# Altium schematic sheet Buck2.SchDoc
size A4; SheetNumber: 4; SheetTotal: 5
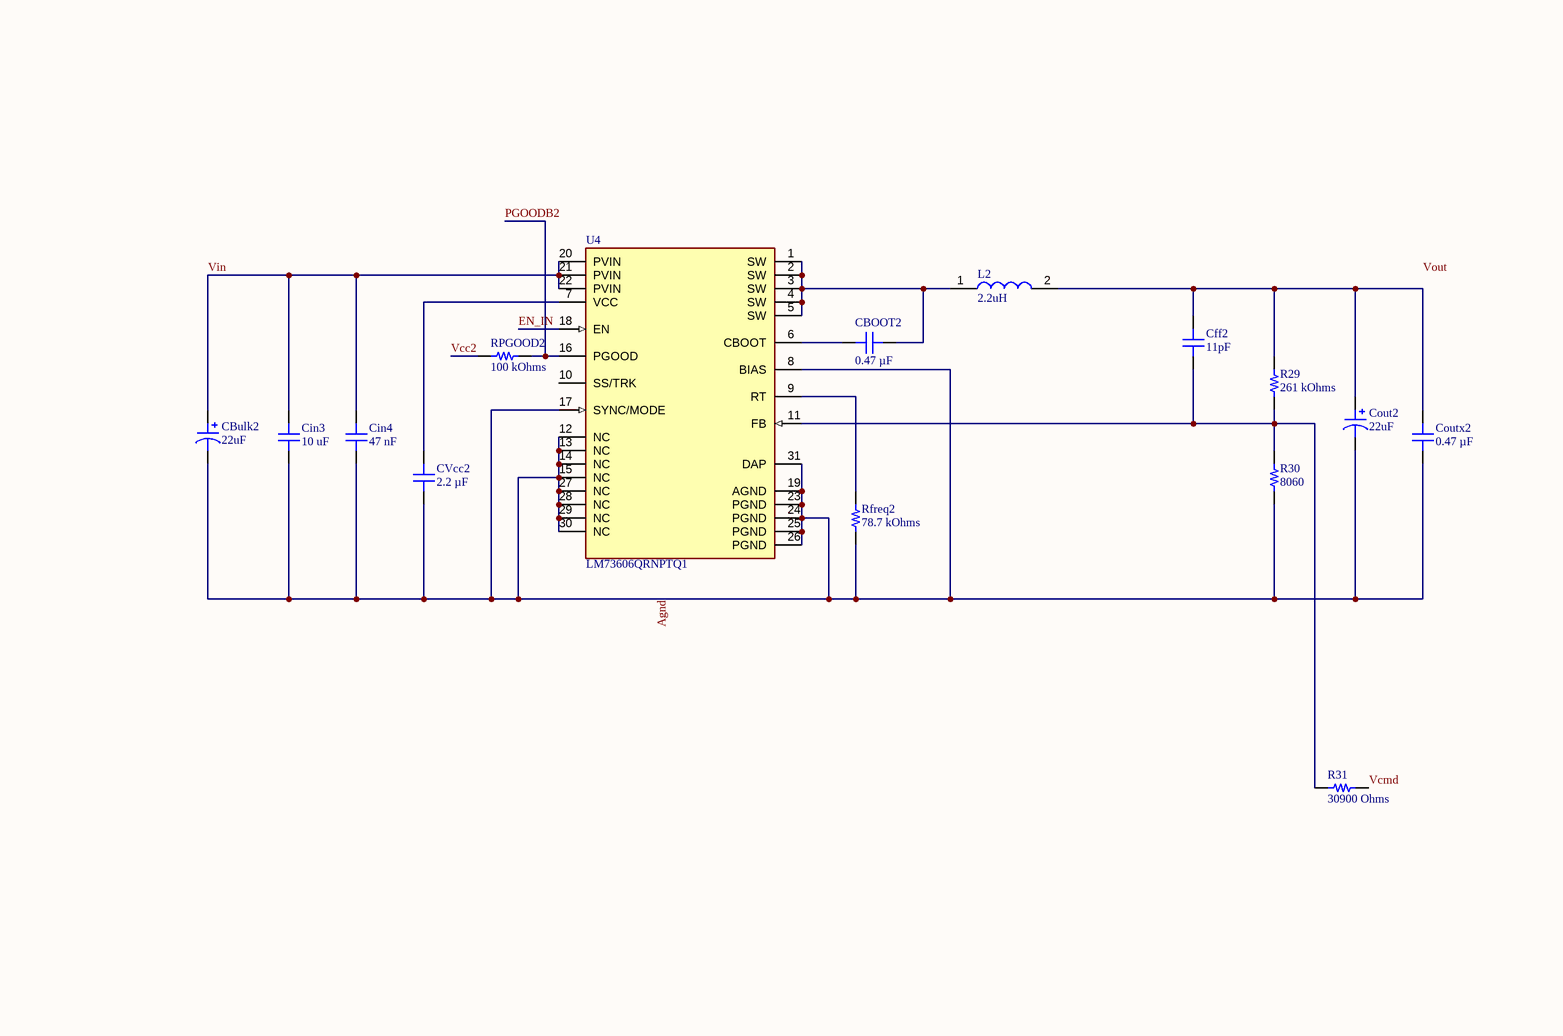
[diagram p0: Buck2.SchDoc]

## Parts
CBOOT2  0.47 µF  [CAP 0603_1608]
CBulk2  22uF  [CAP ALSMD 8.3MM H10.5MM]
Cff2  11pF  [CAP 0603_1608]
Cin3  10 uF  [CAP 0603_1608]
Cin4  47 nF  [CAP 0603_1608]
Cout2  22uF  [CAP ALSMD 8.3MM H10.5MM]
Coutx2  0.47 µF  [CAP 0603_1608]
CVcc2  2.2 µF  [CAP 0603_1608]
L2  2.2uH  [INDPM104104X480N]
R29  261 kOhms  [RES 0603_1608]
R30  8060  [RES 0603_1608]
R31  30900 Ohms  [RES 0603_1608]
Rfreq2  78.7 kOhms  [RES 0603_1608]
RPGOOD2  100 kOhms  [RES 0603_1608]
U4  LM73606QRNPTQ1  [FP-RNP0030A-IPC_C]

## Nets
Agnd: CBulk2.2 Cin3.1 Cin4.1 Cout2.2 Coutx2.1 CVcc2.1 R30.1 Rfreq2.1 U4.8(BIAS) U4.12(NC) U4.13(NC) U4.14(NC) U4.15(NC) U4.17(SYNC/MODE) U4.19(AGND) U4.23(PGND) U4.24(PGND) U4.25(PGND) U4.26(PGND) U4.27(NC) U4.28(NC) U4.29(NC) U4.30(NC) U4.31(DAP)
EN_IN: U4.18(EN)
PGOODB2: RPGOOD2.1 U4.16(PGOOD)
Vcc2: RPGOOD2.2
Vcmd: R31.1
Vin: CBulk2.1 Cin3.2 Cin4.2 U4.20(PVIN) U4.21(PVIN) U4.22(PVIN)
NetCBOOT2_1: CBOOT2.1 U4.6(CBOOT)
NetCBOOT2_2: CBOOT2.2 L2.1 U4.1(SW) U4.2(SW) U4.3(SW) U4.4(SW) U4.5(SW)
NetCff2_1: Cff2.1 R29.1 R30.2 R31.2 U4.11(FB)
NetCff2_2: Cff2.2 Cout2.1 Coutx2.2 L2.2 R29.2
NetCVcc2_2: CVcc2.2 U4.7(VCC)
NetRfreq2_2: Rfreq2.2 U4.9(RT)

Not connected (* = marked no-connect by the designer): U4 10(SS/TRK)

## Notes on the sheet
- Labels drawn without touching a wire or pin: Vout

## Library data of the parts
CBOOT2 Coutx2 = CL10A474KB8NNNC: CAP CER 0.47UF 50V X5R 0603; manufacturer: Samsung Electro-Mechanics; Tolerance: ±10%; Part Number: CL10A474KB8NNNC; Value: 0.47 µF; Applications: General Purpose; Capacitance: 0.47 µF; componentlink1description: Datasheet; componentlink1url: http://www.samsungsem.com/kr/support/product-search/mlcc/CL10A474KB8NNNC.jsp; componentlink2description: DigiKey Link; componentlink2url: https://www.digikey.com/en/products/detail/samsung-electro-mechanics/CL10A474KB8NNNC/3887554; Device Package: 0603 (1608 Metric); lastupdated: 06-07-2023 19:07:50; Lifecycle Status: Active; Minimum Order: 1; Mounting Type: Surface Mount, MLCC; Operating Temperature: -55°C ~ 85°C; Package / Case: 0603 (1608 Metric); packaging: TapeAndReel; partid: 12791; Part Status: Active; price: 0.03; series: CL; Size / Dimension: 0.063" L x 0.031" W (1.60mm x 0.80mm); Supplier 1: DigiKey; Supplier Part Number 1: 1276-1896-1-ND; Temperature Coefficient: X5R; Thickness (Max): 0.035" (0.90mm); Voltage - Rated: 50V
CBulk2 Cout2 = EEE-FK1J680UP: CAP ALUM 68UF 20% 63V SMD; manufacturer: Panasonic Electronic Components; Capacitance: 68 µF; Impedance: 650 mOhms; Lifetime @ Temp.: 2000 Hrs @ 105°C; Polarization: Polar; Ripple Current @ High Frequency: 250 mA @ 100 kHz; Ripple Current @ Low Frequency: 187.5 mA @ 120 Hz; Surface Mount Land Size: 0.327" L x 0.327" W (8.30mm x 8.30mm); value: 68 µF; Part Number: EEE-FK1J680UP; Applications: Automotive; componentlink2description: DigiKey Link; componentlink2url: https://www.digikey.com/en/products/detail/panasonic-electronic-components/EEE-FK1J680UP/949812; Device Package: Radial, Can - SMD; Height - Seated (Max): 0.413" (10.50mm); lastupdated: 06-07-2023 20:33:13; Lifecycle Status: Active; Minimum Order: 1; Mounting Type: Surface Mount; Operating Temperature: -55°C ~ 105°C; Package / Case: Radial, Can - SMD; packaging: TapeAndReel; partid: 7487; Part Status: Active; price: 0.26; Ratings: AEC-Q200; series: FK; Size / Dimension: 0.315" Dia (8.00mm); Supplier 1: DigiKey; Supplier Part Number 1: PCE4307CT-ND; Tolerance: ±20%; Voltage - Rated: 63 V
Cff2 = C0603C105K4RACAUTO: CAP CER 1UF 16V X7R 0603; manufacturer: KEMET; Capacitance: 1 µF; Tolerance: ±10%; Part Number: C0603C105K4RACAUTO; Value: 11pF; Applications: Automotive, Bypass, Decoupling; componentlink1description: Datasheet; componentlink1url: https://api.kemet.com/component-edge/download/datasheet/C0603C105K4RACAUTO.pdf; componentlink2description: DigiKey Link; componentlink2url: https://www.digikey.com/en/products/detail/kemet/C0603C105K4RACAUTO/8635831; Device Package: 0603 (1608 Metric); lastupdated: 06-07-2023 19:08:03; Lifecycle Status: Active; Minimum Order: 1; Mounting Type: Surface Mount, MLCC; Operating Temperature: -55°C ~ 125°C; Package / Case: 0603 (1608 Metric); packaging: TapeAndReel; partid: 2179; Part Status: Active; price: 0.01; Ratings: AEC-Q200; series: SMD Auto X7R; Size / Dimension: 0.063" L x 0.031" W (1.60mm x 0.80mm); Supplier 1: DigiKey; Supplier Part Number 1: 399-17704-1-ND; Temperature Coefficient: X7R; Thickness (Max): 0.037" (0.95mm); Voltage - Rated: 16V
Cin3 Cin4 = C0603C104K5RECAUTO: CAP CER 0.10UF 50V X7R 0603; manufacturer: KEMET; Capacitance: 0.1 µF; Tolerance: ±10%; Part Number: C0603C104K5RECAUTO; Applications: Automotive, ESD Protection; componentlink1description: Datasheet; componentlink1url: https://api.kemet.com/component-edge/download/datasheet/C0603C104K5RECAUTO.pdf; componentlink2description: DigiKey Link; componentlink2url: https://www.digikey.com/en/products/detail/kemet/C0603C104K5RECAUTO/6575893; Device Package: 0603 (1608 Metric); lastupdated: 06-07-2023 19:07:58; Lifecycle Status: Active; Minimum Order: 1; Mounting Type: Surface Mount, MLCC; Operating Temperature: -55°C ~ 125°C; Package / Case: 0603 (1608 Metric); packaging: TapeAndReel; partid: 6683; Part Status: Active; price: 0.03; Ratings: AEC-Q200; series: ESD SMD Auto X7R; Size / Dimension: 0.063" L x 0.031" W (1.60mm x 0.80mm); Supplier 1: DigiKey; Supplier Part Number 1: 399-14105-1-ND; Temperature Coefficient: X7R; Thickness (Max): 0.034" (0.87mm); Voltage - Rated: 50V
  Cin3: Value: 10 uF
  Cin4: Value: 47 nF
CVcc2 = CL10B225KP8NFNC: CAP CER 2.2UF 10V X7R 0603; manufacturer: Samsung Electro-Mechanics; Tolerance: ±10%; Part Number: CL10B225KP8NFNC; Value: 2.2 µF; Applications: General Purpose; Capacitance: 2.2 µF; componentlink1description: Datasheet; componentlink1url: http://www.samsungsem.com/kr/support/product-search/mlcc/CL10B225KP8NFNC.jsp; componentlink2description: DigiKey Link; componentlink2url: https://www.digikey.com/en/products/detail/samsung-electro-mechanics/CL10B225KP8NFNC/3887674; Device Package: 0603 (1608 Metric); lastupdated: 06-07-2023 19:08:02; Lifecycle Status: Active; Minimum Order: 1; Mounting Type: Surface Mount, MLCC; Operating Temperature: -55°C ~ 125°C; Package / Case: 0603 (1608 Metric); packaging: TapeAndReel; partid: 2874; Part Status: Active; price: 0.01; series: CL; Size / Dimension: 0.063" L x 0.031" W (1.60mm x 0.80mm); Supplier 1: DigiKey; Supplier Part Number 1: 1276-2016-1-ND; Temperature Coefficient: X7R; Thickness (Max): 0.035" (0.90mm); Voltage - Rated: 10V
L2 = B82464P4334M000: Inductor; Manufacturer_Name: TDK; Datasheet Link: https://product.tdk.com/system/files/dam/doc/product/inductor/inductor/smd/data_sheet/30/db/ind_2008/b82464p4.pdf; Height: 4.8mm; Manufacturer_Part_Number: B82464P4334M000; Mouser Part Number: 871-B82464P4334M; Mouser Price/Stock: https://www.mouser.co.uk/ProductDetail/EPCOS-TDK/B82464P4334M000/?qs=4t%252Bzdmp%252BdtjuQYJsN6Qp%252BQ%3D%3D; Arrow Part Number: B82464P4334M000; Arrow Price/Stock: https://www.arrow.com/en/products/b82464p4334m000/epcos-tdk
R29-R31 = CPF0603B100KE: RES SMD 100K OHM 0.1% 1/16W 0603; Manufacturer: TE Connectivity Passive Product; Power (Watts): 0.063W, 1/16W; Resistance: 100 kOhms; Temperature Coefficient: ±25ppm/°C; Part Number: CPF0603B100KE; ComponentLink1Description: Datasheet; ComponentLink1URL: https://www.te.com/commerce/DocumentDelivery/DDEController?Action=srchrtrv&DocNm=1773200&DocType=DS&DocLang=English; ComponentLink2Description: DigiKey Link; ComponentLink2URL: https://www.digikey.com/en/products/detail/te-connectivity-passive-product/CPF0603B100KE/2381864; Composition: Thin Film; Device Package: 0603 (1608 Metric); Height - Seated (Max): 0.022" (0.55mm); LastUpdated: 06-07-2023 19:34:44; Lifecycle Status: Active; Minimum Order: 1; Number of Terminations: 2; Operating Temperature: -55°C ~ 155°C; Package / Case: 0603 (1608 Metric); Packaging: TapeAndReel; PartId: 4883; Part Status: Active; Price: 0.09; Series: CPF, Neohm; Size / Dimension: 0.061" L x 0.031" W (1.55mm x 0.80mm); Supplier 1: DigiKey; Supplier Part Number 1: A119912CT-ND; Supplier Device Package: 0603; Tolerance: ±0.1%
  R29: Value: 261 kOhms
  R30: Value: 8060
  R31: Value: 30900 Ohms
Rfreq2 = CPF0603F78K7C1: RES SMD 78.7K OHM 1% 1/16W 0603; Manufacturer: TE Connectivity Passive Product; Power (Watts): 0.063W, 1/16W; Temperature Coefficient: ±50ppm/°C; Part Number: CPF0603F78K7C1; Value: 78.7 kOhms; ComponentLink1Description: Datasheet; ComponentLink1URL: https://www.te.com/commerce/DocumentDelivery/DDEController?Action=srchrtrv&DocNm=1773200&DocType=DS&DocLang=English; ComponentLink2Description: DigiKey Link; ComponentLink2URL: https://www.digikey.com/en/products/detail/te-connectivity-passive-product/CPF0603F78K7C1/2384668; Composition: Thin Film; Device Package: 0603 (1608 Metric); Height - Seated (Max): 0.022" (0.55mm); LastUpdated: 06-07-2023 19:34:36; Lifecycle Status: Active; Minimum Order: 1; Number of Terminations: 2; Operating Temperature: -55°C ~ 155°C; Package / Case: 0603 (1608 Metric); Packaging: TapeAndReel; PartId: 7055; Part Status: Active; Price: 0.02; Resistance: 78.7 kOhms; Series: CPF, Neohm; Size / Dimension: 0.061" L x 0.031" W (1.55mm x 0.80mm); Supplier 1: DigiKey; Supplier Part Number 1: A102318CT-ND; Supplier Device Package: 0603; Tolerance: ±1%
RPGOOD2 = CPF0603B100KE: RES SMD 100K OHM 0.1% 1/16W 0603; Manufacturer: TE Connectivity Passive Product; Power (Watts): 0.063W, 1/16W; Temperature Coefficient: ±25ppm/°C; Part Number: CPF0603B100KE; Value: 100 kOhms; ComponentLink1Description: Datasheet; ComponentLink1URL: https://www.te.com/commerce/DocumentDelivery/DDEController?Action=srchrtrv&DocNm=1773200&DocType=DS&DocLang=English; ComponentLink2Description: DigiKey Link; ComponentLink2URL: https://www.digikey.com/en/products/detail/te-connectivity-passive-product/CPF0603B100KE/2381864; Composition: Thin Film; Device Package: 0603 (1608 Metric); Height - Seated (Max): 0.022" (0.55mm); LastUpdated: 06-07-2023 19:34:44; Lifecycle Status: Active; Minimum Order: 1; Number of Terminations: 2; Operating Temperature: -55°C ~ 155°C; Package / Case: 0603 (1608 Metric); Packaging: TapeAndReel; PartId: 4883; Part Status: Active; Price: 0.09; Resistance: 100 kOhms; Series: CPF, Neohm; Size / Dimension: 0.061" L x 0.031" W (1.55mm x 0.80mm); Supplier 1: DigiKey; Supplier Part Number 1: A119912CT-ND; Supplier Device Package: 0603; Tolerance: ±0.1%
U4 = CMP-04918-000121-1: IC REG BUCK ADJUSTABLE 6A 30WQFN; Manufacturer: Texas Instruments; Standoff Height: 0mm; Automotive Grade: Grade 1; Max Duty Cycle: 97.5%; Switching Frequency: 350-2200kHz; Max Supply Voltage: 36V; Min Supply Voltage: 3.5V; Output Voltage: 1-34V; Max Junction Temp: +150°C; Output Type: AdjustableProgrammable; Number Of Outputs: 1; Nominal Supply Current: 15uA; Automotive: Yes; Manufacturer Part Number: LM73606QRNPTQ1; Ambient Temperature Range High: +125°C; Temperature Range Low: -40°C; Device Class L1: Integrated Circuits (ICs); Output Current: 6A; Device Class L3: Voltage Regulators - Switching; Temperature Range High: +125°C; Lead Free: Yes; Mouser Description: 3.5V to 36V, 6A Synchronous Step-Down Voltage Converter 30-WQFN -40 to 125; RoHS: TRUE; Device Class L2: Power Management ICs; Package: RNP0030A; Height: 0.8mm; Category: IC; Octopart: https://octopart.com/lm73606qrnptq1-texas+instruments-87960447; ComponentLink2URL: http://www.ti.com/lit/ds/symlink/lm73605-q1.pdf; ComponentLink2Description: Datasheet; Switching Topology: Buck; Ambient Temperature Range Low: -40°C; Digikey Description: IC REG BUCK ADJUSTABLE 6A 30WQFN; Temperature: -40°C to +125°C